# EAGLE design admp510 (EAGLE 7.4.0)
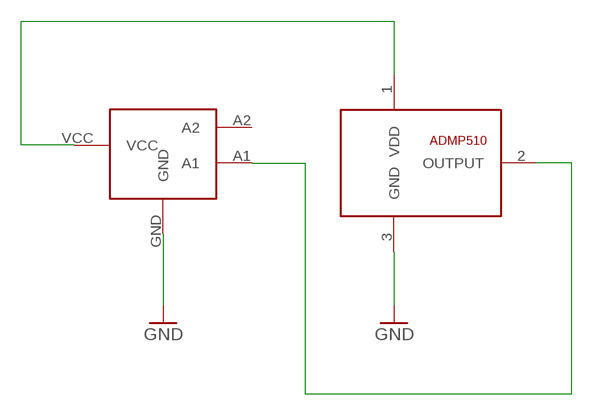
[diagram p0: schematic, sheet 1]

## Parts
U$1  ANALOGDEVICES-ADMP510  [ANALOGDEVICES-ADMP510]
U$2  4PIN  [4PIN]

## Nets
GND: U$1.3(GND) U$2.GND
N$1: U$1.1(VDD) U$2.VCC
N$4: U$1.2(OUTPUT) U$2.A1
Unconnected: U$2.A2

## Library data of the parts
U$1 = FaBo-Mems:ANALOGDEVICES-ADMP510
U$2 = FaBo-Breakout:4PIN

## Board
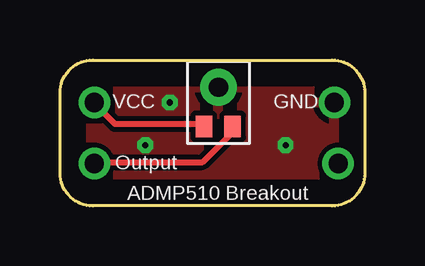
[diagram p1: board, top side]
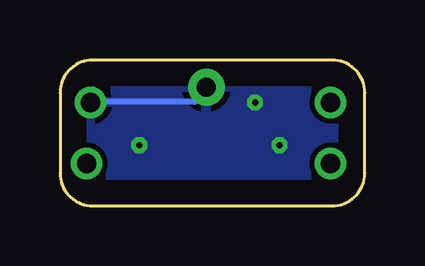
[diagram p2: board, bottom side, seen from below]

Size 12.7 x 6.08 mm. Coordinates in mm from the lower left corner, seen from the top.
Copper layers (1*16): Top 0.035mm / dielectric 1.5mm / Bottom 0.035mm
Design rules "default": minimum track width 10mil, minimum drill 24mil, track to track 8mil, track to pad 8mil, pad to pad 8mil, via to via 8mil, smd to smd 8mil, copper to edge 40mil, drill to drill 8mil, minimum pad ring 10mil, minimum via ring 8mil, stop-mask expansion 4mil, vias tented up to drill 0mil, thermal gap 10mil

### Footprints (pad centres in the part's own frame; a part is rotated, then mirrored left to right if it is on the bottom)
ANALOGDEVICES-ADMP510 = smd 0.9 x 0.68: 1 1,-0.61; 2 1,0.59 | drill 0.8 pad 1.524: 3 -0.635,0
4PIN = drill 0.8: A1 -4.92,-1.27; A2 5.24,-1.27; GND 5.08,1.27; VCC -4.92,1.27

### Placement (x,y rotation side)
U$1  6.6,4.31 270 top
U$2  6.35,3.04 0 top

### Tracks (layer width: path | path; a pad name or v marks a point on that pad's centre or on a via)
GND  (via drill 0.25)
  Bottom 0.254: U$2.GND 11.43,4.33 7.09,4.33 6.63,4.79 U$1.3
  other vias: 4.57,4.31 3.56,2.53 9.4,2.53
  pour Bottom: 0,-0.01 12.7,-0.01 12.7,7.61 0,7.61
  pour Top: 0,-0.01 12.7,-0.01 12.7,7.61 0,7.61
N$1
  Top 0.254: U$1.1 5.94,3.42 2.29,3.42 1.6,4.11 U$2.VCC
N$4
  Top 0.254: U$1.2 7.09,3.19 7.09,2.96 5.94,1.82 1.6,1.82 U$2.A1

### Text on the board
tPlace: Output | ADMP510 Breakout